# Altium schematic sheet DAC_8Bit.SchDoc
size B
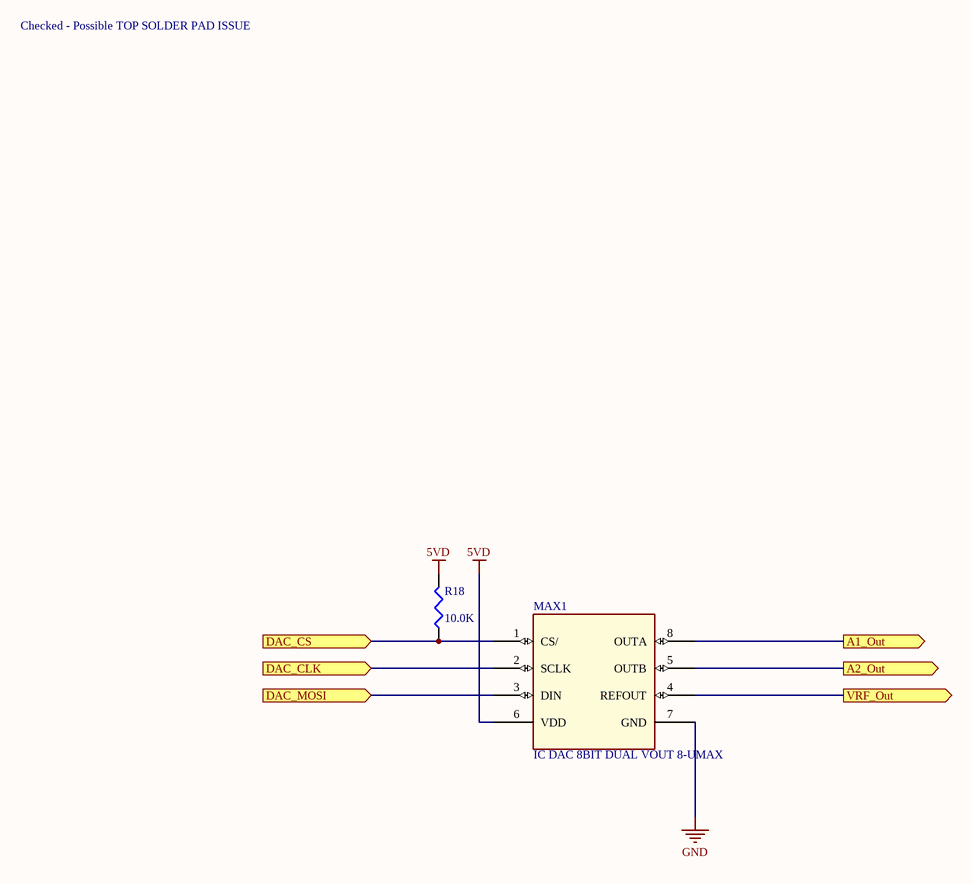
[diagram p0: DAC_8Bit.SchDoc]

## Parts
MAX1  IC DAC 8BIT DUAL VOUT 8-UMAX  [TSOP65P490X110-8M]
R18  value 10.0K  [RESC2112X05M]  (hidden comment: Res3)

## Ports
A1_Out (out), A2_Out (out), DAC_CLK (in), DAC_CS (in), DAC_MOSI (in), VRF_Out (out)

## Nets
5VD: MAX1.6(VDD) R18.2
GND: MAX1.7(GND)
A1_Out: MAX1.8(OUTA) ; port A1_Out
A2_Out: MAX1.5(OUTB) ; port A2_Out
DAC_CLK: MAX1.2(SCLK) ; port DAC_CLK
DAC_CS: MAX1.1(CS/) R18.1 ; port DAC_CS
DAC_MOSI: MAX1.3(DIN) ; port DAC_MOSI
VRF_Out: MAX1.4(REFOUT) ; port VRF_Out

## Notes on the sheet
- Checked - Possible TOP SOLDER PAD ISSUE
- ESE
- is the sole property of ESE. Any reproduction
- The Information Contained in this drawing
- Schematic P/N and Name
- Sheet Name
- 299 Doon Valley Drive
- Kitchener, ON N2G 4M4
- Canada
- Approved
- in part or in whole without the written
- permission of ESE is strictly prohibited.
- APPROVALS
- DATE
- Size
- Scale
- B
- NTS
- Bare PCB P/N
- Date
- Sheet
- Rev.
- Checked
- Engineer
- of

## Library data of the parts
MAX1 = Max5513-dac: MPN: MAX5513EUA+; PN: MAX5513EUA+-ND; URL: http://www.digikey.ca/product-detail/en/MAX5513EUA%2B/MAX5513EUA%2B-ND
R18 = Resistor_10.0K: RES SMD 10.0K OHM 1% 1/8W 0805; MPN: CRCW080510K0FKEA; PN: 541-10.0KCCT-ND; Name: Resistor_10.0K; URL: http://www.digikey.ca/product-detail/en/CRCW080510K0FKEA/541-10.0KCCT-ND